# Altium schematic sheet DistBoard.SchDoc
size A; SheetNumber: 1; SheetTotal: 1
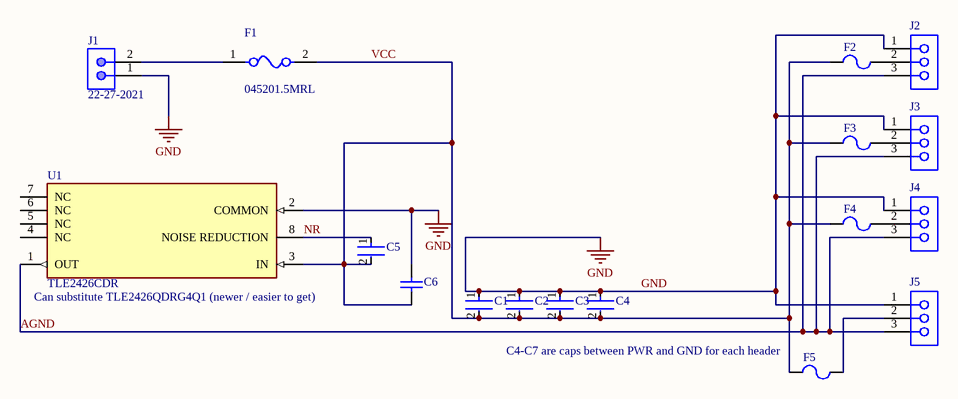
[diagram p0: DistBoard.SchDoc]

## Parts
C1  GCJ21BR71H105KA01L  [FP-GCJ21B-0_3-IPC_B]  (value not drawn)
C2  GCJ21BR71H105KA01L  [FP-GCJ21B-0_3-IPC_B]  (value not drawn)
C3  GCJ21BR71H105KA01L  [FP-GCJ21B-0_3-IPC_B]  (value not drawn)
C4  GCJ21BR71H105KA01L  [FP-GCJ21B-0_3-IPC_B]  (value not drawn)
C5  GCD21BR71H104KA01L  [FP-GCD21B-0_15-IPC_C]  (value not drawn)
C6  C1206C105K5RACTU  [CAPC3216X110X50LL20T25]  (value not drawn)
F1  045201.5MRL  [FP-0452-MFG]
F2  0459.250UR  [LFUS-459_V]  (value not drawn)
F3  0459.250UR  [LFUS-459_V]  (value not drawn)
F4  0459.250UR  [LFUS-459_V]  (value not drawn)
F5  0459.250UR  [LFUS-459_V]  (value not drawn)
J1  22-27-2021  [MOLX-22-27-2021_V]
J2  SSM-103-L-SV  [SMTC-SSM-103-X-SV]  (value not drawn)
J3  SSM-103-L-SV  [SMTC-SSM-103-X-SV]  (value not drawn)
J4  SSM-103-L-SV  [SMTC-SSM-103-X-SV]  (value not drawn)
J5  SSM-103-L-SV  [SMTC-SSM-103-X-SV]  (value not drawn)
U1  TLE2426CDR  [FP-D0008A-IPC_B]

## Nets
GND: C1.1 C2.1 C3.1 C4.1 C6.2 J1.1 J2.1 J3.1 J4.1 J5.1 U1.2(COMMON)
AGND: J2.3 J3.3 J4.3 J5.3 U1.1(OUT)
NR: C5.1 U1.8(NOISE_REDUCTION)
VCC: C1.2 C2.2 C3.2 C4.2 C5.2 C6.1 F1.2 F2.1 F3.1 F4.1 F5.1 U1.3(IN)
NetF1_1: F1.1 J1.2
NetF2_2: F2.2 J2.2
NetF3_2: F3.2 J3.2
NetF4_2: F4.2 J4.2
NetF5_2: F5.2 J5.2

Not connected (* = marked no-connect by the designer): U1 4(NC) 5(NC) 6(NC) 7(NC)

## Notes on the sheet
- Can substitute TLE2426QDRG4Q1 (newer / easier to get)
- (near F5) C4-C7 are caps between PWR and GND for each header

## Library data of the parts
C1-C4 = CMP-06035-043290-1: Manufacturer: Murata; Voltage Rating (DC): 50V; Tolerance: 10%; Capacitance: 1uF; Dielectric: X7R; Value: 1uF; Max Operating Temperature: 125°C; Ratings: AEC-Q200; Height: 1.25mm; Lead Free: Lead Free; Weight: 0.000335oz; Thickness: 0.057inch; Min Operating Temperature: -55°C; Termination: SMD/SMT; Features: Soft Termination; Mount: Surface Mount; Voltage Rating: 50V; Case Code (Imperial): 0805; Package Quantity: 3000; Width: 0.049inch; Case/Package: 0805; Case Code (Metric): 2012; Packaging: Tape and Reel; Length: 0.079inch; Manufacturer Part Number: GCJ21BR71H105KA01L
C5 = CMP-06035-045527-1: Manufacturer: Murata; Voltage Rating: 50V; Capacitance: 100nF; Dielectric: X7R; Tolerance: 10%; Value: 100nF; Case Code (Metric): 2012; Height: 1.25mm; Weight: 0.000335oz; Mount: Surface Mount; Width: 0.049inch; Packaging: Tape and Reel; Min Operating Temperature: -55°C; Depth: 1.25mm; Length: 2mm; Max Operating Temperature: 125°C; Ratings: AEC-Q200; Termination: SMD/SMT; Thickness: 0.049inch; Case/Package: 0805; Voltage Rating (DC): 50V; Case Code (Imperial): 0805; Package Quantity: 3000; Manufacturer Part Number: GCD21BR71H104KA01L
C6 = CMP-2000-06011-1: Chip Capacitor, 1 uF, +/- 10%, 50 V, -55 to 125 degC, 1206 (3216 Metric), RoHS, Tape and Reel; Manufacturer: Kemet; Case Height: 1mm; Dielectric: X7R; Voltage Rating: 50V; Capacitance: 1uF; Temperature Coefficient / Code: +/-15%; Case Length: 3.2mm; Case Width: 1.6mm; Type: SMDMLCCX7R6.3-250VDCCommericalGrade; Class: Class1; Capacitance - nF: 1000nF; Value: 1uF; Datasheet URL: http://www.kemet.com/docfinder?Partnumber=C1206C105K5RACTU; Product Category: MultilayerCeramicCapacitorsMLCC-SMD/SMT; Termination Style: SMD/SMT; Dimensions: 1.6mmWx3.2mmLx1mmH; Voltage Rating DC: 50V; Datasheet Version: 02/2016; Packaging: Reel; Brand: Kemet; RoHS: Details; Minimum Operating Temperature: -55C; Operating Temperature Range: -55Cto+125C; Package Reference: 1206; Manufacturer URL: http://www.kemet.com/; Product: GeneralTypeMLCCs; Tolerance: 10%; Package Description: 2-Pin Surface Mount Device, Body 3.2 x 1.6 mm; Mounting Technology: SurfaceMount; Case Code - mm: 3216; Maximum Operating Temperature: +125C; Series: C1206C; Factory Pack Quantity: 2500; Package / Case: 1206(3216metric); Case Code - in: 1206; Manufacturer Part Number: C1206C105K5RACTU; Price: 0.053
F1 = CMP-08605-000038-1: FUSE BRD MNT 1.5A 125VAC/VDC SMD; Manufacturer: Littelfuse Inc; Value: 0.093Ω; Fuse Interrupt Ac Current: 50A; Max Fuse Dc Voltage: 125V; Fuse Blow Speed: Slow; Fuse I2T: 3.65A2Sec; Fuse Interrupt Dc Current: 300A; Device Class L2: Fuses; Device Class L3: unset; Temperature Range High: +125°C; Manufacturer Part Number: 045201.5MRL; Temperature: -55°C to +125°C; Fuse Current: 1.5A; ComponentLink2Description: Datasheet; Temperature Range Low: -55°C; Resistance: 0.093Ω; Package: 0452; RoHS: TRUE; Max Fuse Ac Voltage: 125V; Category: Fuse; Mouser Description: Surface Mount Fuses 125V 1.5A; Device Class L1: Circuit Protection; Octopart: https://octopart.com/045201.5mrl-littelfuse-566412; ComponentLink2URL: https://www.littelfuse.com/~/media/electronics/datasheets/fuses/littelfuse_fuse_452_454_datasheet.pdf.pdf; Lead Free: Yes; Automotive: No; Height: 2.94mm; Digikey Description: FUSE BRD MNT 1.5A 125VAC/VDC SMD; Voltage Rating: 125V
F2-F5 = CMP-2000-05720-1: Fuse, 125 V, 250 mA, -55 to 125 degC, 2-Pin SMD, RoHS, Tape and Reel; Manufacturer: Littelfuse; Type: PicoSurfaceMountVeryFastActingFuse; Current Rating: 250mA; Voltage Rating DC: 125V; Interrupt Rating: 300Amps; Case Height: 3.05mm; Resistance: 665mOhms; Case Length: 7.24mm; Fuse Type: FastBlow; Fuse Size / Group: PICO; Case Width: 4.32mm; Product: SurfaceMountFuses; Series: 459; Brand: Littelfuse; Factory Pack Quantity: 500; RoHS: Details; Operating Temperature Range: -55Cto+125C; Packaging: Reel; Datasheet Version: 11/2015; Package Reference: 459; Package Description: 2-Pin Surface Mount Device, Body 7.24 x 4.32 mm; Product Type: SurfaceMountFuse; Dimensions: 7.24mmLx4.32mmW; Mounting Technology: SurfaceMount; Datasheet URL: http://www.littelfuse.com/~/media/electronics/datasheets/fuses/littelfuse_fuse_459_datasheet.pdf.pdf; Manufacturer URL: http://www.littelfuse.com/; Product Category: SurfaceMountFuses; Manufacturer Part Number: 0459.250UR
J1 = CMP-2000-05537-1: Male Header, Pitch 2.54 mm, 1 x 2 Position, Height 11.7 mm, Tail Length 3.56 mm, 0 to 75 degC, RoHS, Bulk; Manufacturer: Molex; PartNumber: 0022272021; Current rating: 4A; Package Version: Rev. BC, 02/2012; Voltage rating: 250V; No. of Positions: 2; Pitch: 2.54mm; No. of Rows: 1; Orientation: Vertical; Operating temperature: 0°Cto+75°C; Manufacturer URL: http://www.molex.com/; Mounting Technology: ThroughHole; Housing material: Nylon(UL94V-0); Package Description: 2-Leads Header, Body 5.08 x 5.8 mm, Pitch 2.54 mm; Voltage - Max: 250V; Datasheet URL: http://www.molex.com/pdm_docs/sd/022272021_sd.pdf; Package Reference: 22-27-2021; Contact material: Tinplatedbrass; Current - Max: 4A; Datasheet Version: Rev. F, 06/2009; Manufacturer Part Number: 22-27-2021
J2-J5 = CMP-1023-00201-1: Manufacturer: Samtec; Pitch: 2.54 mm; Orientation: Vertical; Temperature Range: -55 to 125 degC; ComponentLink2URL: http://www.samtec.com/documents/webfiles/pdf/SSM_SM.PDF; DatasheetVersion: F-214; PackageDescription: .100 C.L. Surface Mount Socket Strip; PackageVersion: CR, 9/1998; ComponentLink1Description: Manufacturer URL; PackageReference: SSM-103-X-SV; ComponentLink3URL: http://www.samtec.com/documents/webfiles/cpdf/SSM-1XX-XXX-XX-XX-XX-X-XX-XX-MKT.pdf; RoHS: True; ComponentLink2Description: Datasheet; ComponentLink1URL: http://www.samtec.com; Mounting Technology: Surface Mount; ComponentLink3Description: Package Specification; PartNumber: SSM-103-L-SV; Manufacturer Part Number: SSM-103-L-SV
U1 = CMP-04916-000011-1: Manufacturer: Texas Instruments; Max Input Voltage: 40V; Temperature Coefficient: 35ppm/°C; Reference Type: Ground Reference (Virtual); Operating Supply Current: 400uA; Min Output Voltage: 2V; Max Output Current: 20mA; Max Output Voltage: 20V; Output Type: Adjustable; Tolerance: 1%; Height: 1.58mm; Mount: Surface Mount; Max Operating Temperature: 125°C; Length: 4.9mm; Case/Package: SOIC; Weight: 0.002677oz; Radiation Hardening: No; REACH SVHC: No SVHC; Output Voltage: 20V; Output Current: 20mA; Min Operating Temperature: -55°C; Package Quantity: 1; Packaging: Tape and Reel; Number of Pins: 8; Width: 3.91mm; Lead Free: Lead Free; Reference Voltage: 20V; Manufacturer Part Number: TLE2426CDR